# Altium schematic sheet Half_Bridge.SchDoc
size A
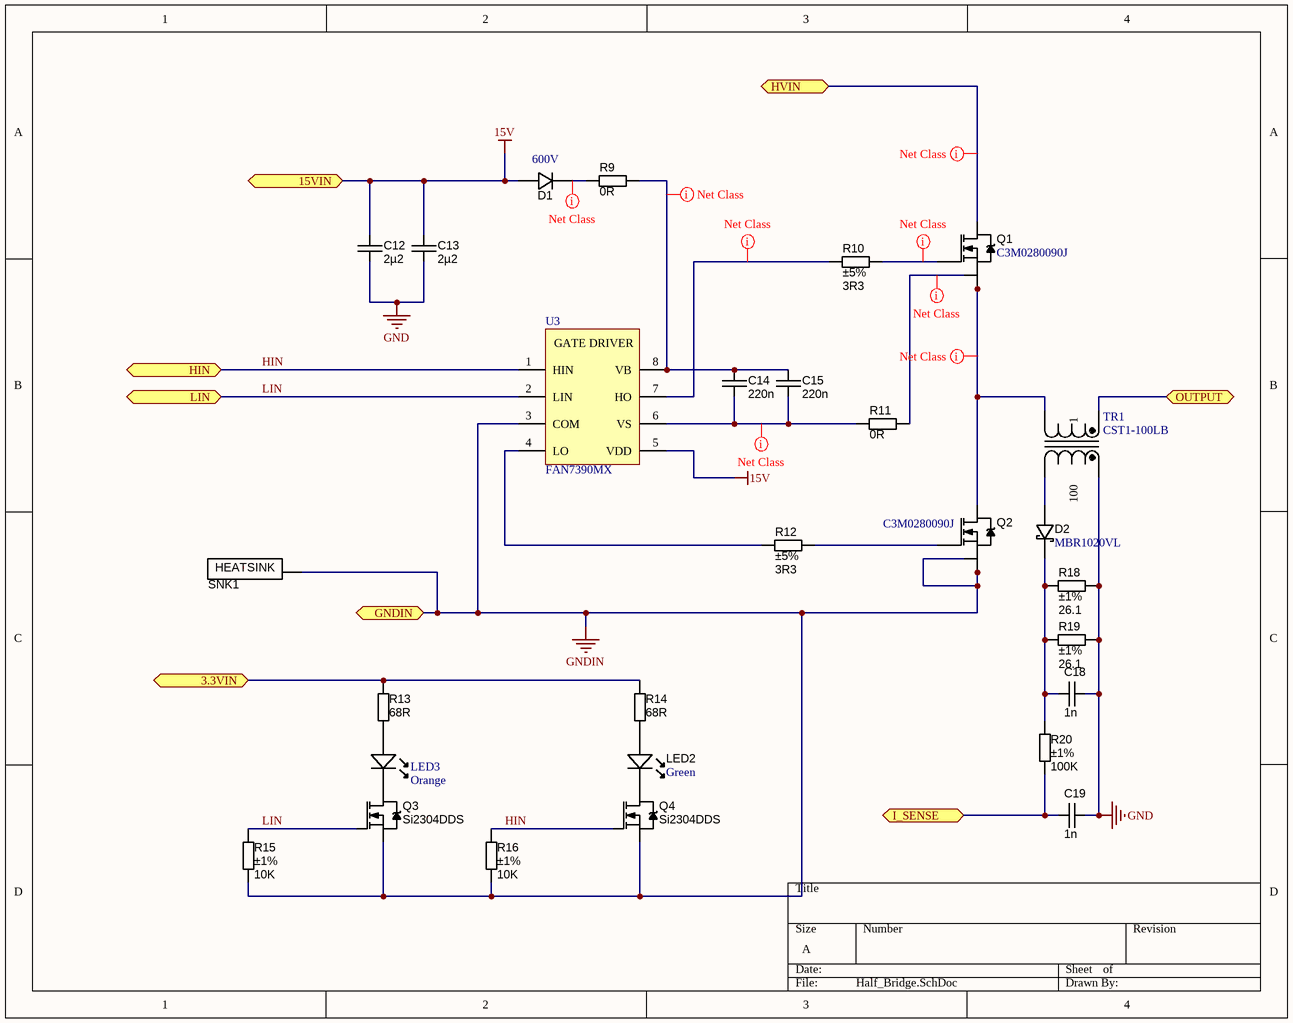
[diagram p0: Half_Bridge.SchDoc]

## Parts
C12  value 2µ2  [CAPC3216X180N]  (hidden comment: approved sub OK)
C13  value 2µ2  [CAPC3216X180N]  (hidden comment: approved sub OK)
C14  value 220n  [CAPC1632X07N]  (hidden comment: approved sub OK)
C15  value 220n  [CAPC1632X07N]  (hidden comment: approved sub OK)
C18  value 1n  [CAPC1608X90N]  (hidden comment: approved sub OK)
C19  value 1n  [CAPC1608X90N]  (hidden comment: approved sub OK)
D1  Voltage - DC Reverse (Vr) (Max): 600V  [DO-214AA]  (hidden comment: ER2J-LTP)
D2  Manufacturer Part Number: MBR1020VL  [SOD123F]  (hidden comment: B320A-13-F)
LED2  Color: Green  [LED-0603-GREEN]  (hidden comment: APT1608CGCK)
LED3  Color: Orange  [LED-0603-AMBER]  (hidden comment: LO L296-Q2S1-24-Z)
Q1  Manufacturer Part Number: C3M0280090J  [DPAK127P1618X457-8N]  (hidden comment: C3M0065090D)
Q2  Manufacturer Part Number: C3M0280090J  [DPAK127P1618X457-8N]  (hidden comment: C3M0065090D)
Q3  Si2304DDS  [SOT23-3]
Q4  Si2304DDS  [SOT23-3]
R9  value 0R  [RESC2012X70N]  (hidden comment: Jumper)
R10  value 3R3  Tolerance: ±5%  [RESC2012X70N]  (hidden comment: Thick Film)
R11  value 0R  [RESC2012X70N]  (hidden comment: Jumper)
R12  value 3R3  Tolerance: ±5%  [RESC2012X70N]  (hidden comment: Thick Film)
R13  value 68R  [RESC1608X55N]  (hidden comment: Thick Film)
R14  value 68R  [RESC1608X55N]  (hidden comment: Thick Film)
R15  value 10K  Tolerance: ±1%  [RESC1005X40N]  (hidden comment: Thick Film)
R16  value 10K  Tolerance: ±1%  [RESC1005X40N]  (hidden comment: Thick Film)
R18  value 26.1  Tolerance: ±1%  [RESC2012X70N]  (hidden comment: Thick Film)
R19  value 26.1  Tolerance: ±1%  [RESC2012X70N]  (hidden comment: Thick Film)
R20  value 100K  Tolerance: ±1%  [RESC1608X55N]  (hidden comment: Thick Film)
SNK1  ATS-CPX025025010-137-C2-R0  [HeatSink ATS-CPX025025010-165-C2-R0]  (value not drawn)
TR1  CST1-100LB  [CST1]
U3  FAN7390MX  [SOIC127P600X175-8AN]

## Ports
3.3VIN, 15VIN, GNDIN, HIN, HVIN, I_SENSE, LIN, OUTPUT

## Nets
15V: C12.1 C13.1 D1.A U3.5(VDD) ; port 15VIN
GND: C12.2 C13.2 C18.2 C19.2 R18.2 R19.2 TR1.6
GNDIN: Q2.2 Q2.3(S) Q2.4 Q2.5 Q2.6 Q2.7 Q3.2(S) Q4.2(S) R15.2 R16.2 SNK1.1(GND) U3.3(COM) ; port GNDIN
3.3VIN: R13.1 R14.1 ; port 3.3VIN
HIN: Q4.1(G) R16.1 U3.1(HIN) ; port HIN
HVIN: Q1.8(D) ; port HVIN
I_SENSE: C19.1 R20.1 ; port I_SENSE
LIN: Q3.1(G) R15.1 U3.2(LIN) ; port LIN
OUTPUT: TR1.8 ; port OUTPUT
NetC14_1: C14.1 C15.1 R9.2 U3.8(VB)
NetC14_2: C14.2 C15.2 R11.1 U3.6(VS)
NetC18_1: C18.1 D2.K R18.1 R19.1 R20.2
NetD1_K: D1.K R9.1
NetD2_A: D2.A TR1.4
NetLED2_A: LED2.A R14.2
NetLED2_K: LED2.K Q4.3(D)
NetLED3_A: LED3.A R13.2
NetLED3_K: LED3.K Q3.3(D)
NetQ1_1: Q1.1(G) R10.2
NetQ1_2: Q1.2 R11.2
NetQ1_3: Q1.3(S) Q1.4 Q1.5 Q1.6 Q1.7 Q2.8(D) TR1.7
NetQ2_1: Q2.1(G) R12.2
NetR10_1: R10.1 U3.7(HO)
NetR12_1: R12.1 U3.4(LO)

## Layout directives
net class BOOT_S: NetC14_1, NetC14_2, NetD1_K, NetQ1_1, NetQ1_2, NetQ1_3, NetR10_1
net class 350V: HVIN

## Notes on the sheet
- (in symbol CURRENT_100:1_20A_CST1-100LB) 1; 100
- (in symbol GATE_DRV_2_600V_4.5A) GATE DRIVER
- (in symbol HEATSINK_25mmx25mm_ATS-CPX025025010-137-C2-R0) HEATSINK

## Library data of the parts
C12 C13 = CAPC_2u2_50V_1206: Capacitor SMD Cer 2.2uF 10% 50V X7R 1206; SCDType: undef; Tolerance: ±10%; Supplier 1: Digi-Key; Supplier Part Number 1: 1276-1291-1-ND
C14 C15 = CAPC_220n_0612_X7R_25V_10%: Capacitor SMD Cer 220nF 10% 25V X7R 0612; Manufacturer: AVX Corporation; Manufacturer Part Number: 06123C224KAT2A; Tolerance: ±20%; Voltage - Rated: 25V; Supplier 1: Digi-Key; Supplier Part Number 1: 478-2902-1-ND; RoHS: RoHS Compliant; Category: Capacitors; Stock 1: 3680; Pricing 1: 1=1.73, 10=1.366, 100=1.0247, 500=0.77418, 1000=0.6831 (USD); Packaging: Cut Tape (CT); Part Status: Active; Temperature Coefficient: X7R; Operating Temperature: -55°C ~ 125°C; Features: Low ESL (Reverse Geometry); Ratings: -; Applications: Bypass, Decoupling; Mounting Type: Surface Mount, MLCC; Package / Case: 0612 (1632 Metric); Size / Dimension: 0.063" L x 0.126" W (1.60mm x 3.20mm); Height - Seated (Max): -; Thickness (Max): 0.050" (1.27mm); Lead Spacing: -; Lead Style: -; ComponentLink1URL: http://datasheets.avx.com/licc.pdf; ComponentLink1Description: http://datasheets.avx.com/licc.pdf
C18 C19 = CAPC_1n_0603_X7R_100V_10%: Capacitor SMD Cer 1nF 10% 100V X7R 0603; Manufacturer 1: Murata Electronics North America; Manufacturer Part Number 1: GCM188R72A102KA37D; Ratings: 100V; X7R; Material: ceramic; SCDType: spec; Package / Case: 0603 (1608 metric); Tolerance: ±10%; Supplier 1: Digi-Key; Supplier Part Number 1: 490-4780-1-ND; Operating Temperature: -55°C ~ 125°C; Size / Dimension: 0.063" L x 0.031" W (1.60mm x 0.80mm); Thickness (Max): 0.035" (0.90mm); ComponentLink1URL: http://search.murata.co.jp/Ceramy/image/img/PDF/ENG/GCM188R72A102KA37.pdf; ComponentLink1Description: http://search.murata.co.jp/Ceramy/image/img/PDF/ENG/GCM188R72A102KA37.pdf
D1 = DIODE_600V_2A_ER2J-LTP: Diode Standard 600V 2A Surface Mount DO-214AA (SMB); Manufacturer: Micro Commercial Co; Voltage - Forward (Vf) (Max) @ If: 1.7V @ 2A; Speed: Fast Recovery =< 500ns, > 200mA (Io); Current - Reverse Leakage @ Vr: 5µA @ 600V; Capacitance @ Vr, F: 15pF @ 4V, 1MHz; Supplier 1: Digi-Key; Supplier Part Number 1: ER2J-LTPMSCT-ND; RoHS: RoHS Compliant; Category: Discrete Semiconductor Products; Stock 1: 527; Pricing 1: 1=0.51, 10=0.362, 25=0.2976, 100=0.2379, 250=0.17304, 500=0.1406, 1000=0.10815 (USD); Packaging: Cut Tape (CT); Part Status: Active; Diode Type: Standard; Current - Average Rectified (Io): 2A; Mounting Type: Surface Mount; Package / Case: DO-214AA, SMB; Supplier Device Package: DO-214AA (SMB); Operating Temperature - Junction: -65°C ~ 175°C; ComponentLink1URL: http://www.mccsemi.com/up_pdf/ER2A-L~ER2J-L(DO-214AA).pdf; ComponentLink1Description: http://www.mccsemi.com/up_pdf/ER2A-L~ER2J-L(DO-214AA).pdf; Manufacturer Part Number: ER2J-LTP
D2 = DIODE_SCHOTTKY_20V_1A_MBR1020VL: Diode Schottky 20V 1A Surface Mount SOD-123F; Manufacturer: Fairchild/ON Semiconductor; Voltage - Forward (Vf) (Max) @ If: 340mV @ 1A; Speed: Fast Recovery =< 500ns, > 200mA (Io); Current - Reverse Leakage @ Vr: 600µA @ 20V; Supplier 1: Digi-Key; Supplier Part Number 1: MBR1020VLCT-ND; RoHS: RoHS Compliant; Category: Discrete Semiconductor Products; Stock 1: 10857; Pricing 1: 1=0.39, 10=0.293, 100=0.1661, 500=0.11, 1000=0.08433 (USD); Packaging: Cut Tape (CT); Part Status: Active; Diode Type: Schottky; Current - Average Rectified (Io): 1A; Capacitance @ Vr, F: -; Mounting Type: Surface Mount; Package / Case: SOD-123F; Supplier Device Package: SOD-123F; Operating Temperature - Junction: -55°C ~ 125°C; ComponentLink1URL: https://www.fairchildsemi.com/datasheets/MB/MBR1020VL.pdf; ComponentLink1Description: https://www.fairchildsemi.com/datasheets/MB/MBR1020VL.pdf
LED2 = LED_SMD_Green_0603_50mcd: Green 570nm LED Indication - Discrete 2.1V 0603 (1608 Metric); Manufacturer: Kingbright; Lens Color: Colorless; Lens Transparency: Clear; Millicandela Rating: 50mcd; Lens Style/Size: Rectangle with Flat Top, 1.20mm x 0.80mm; Current - Test: 20mA; Viewing Angle: 120°; Wavelength - Peak: 574nm; Supplier 1: Digi-Key; Supplier Part Number 1: 754-1116-1-ND; Manufacturer Part Number: APT1608CGCK; Packaging: Cut Tape (CT); Part Status: Active; Voltage - Forward (Vf) (Typ): 2.1V; Mounting Type: Surface Mount; Wavelength - Dominant: 570nm; Features: -; Package / Case: 0603 (1608 Metric); Supplier Device Package: Chip LED; Size / Dimension: 1.60mm L x 0.80mm W; Height (Max): 0.75mm; ComponentLink1URL: http://www.kingbrightusa.com/images/catalog/SPEC/APT1608CGCK.pdf; ComponentLink1Description: http://www.kingbrightusa.com/images/catalog/SPEC/APT1608CGCK.pdf; RoHS: RoHS Compliant; Category: Optoelectronics; Stock 1: 896844; Pricing 1: 1=0.47, 10=0.337, 25=0.258, 100=0.1683, 250=0.12344, 500=0.10472, 1000=0.08602 (USD)
LED3 = LED_0603_Orange: LED ORANGE DIFFUSED 0603 SMD; Manufacturer: OSRAM Opto Semiconductors Inc.; Lens Color: White; Millicandela Rating: 157mcd; Lens Style/Size: Rectangle with Flat Top, 1.30mm x 0.80mm; Voltage - Forward (Vf) (Typ): 2V; Current - Test: 20mA; Viewing Angle: 160°; Wavelength - Dominant: 605nm; Supplier 1: Digi-Key; Manufacturer Part Number: LO L296-Q2S1-24-Z; Packaging: Cut Tape (CT); Part Status: Active; Lens Transparency: Diffused; Mounting Type: Surface Mount; Wavelength - Peak: -; Features: -; Package / Case: 0603 (1608 Metric); Size / Dimension: 1.70mm L x 0.80mm W; Height (Max): 0.65mm; ComponentLink1URL: http://www.osram-os.com/Graphics/XPic9/00077122_0.pdf; ComponentLink1Description: http://www.osram-os.com/Graphics/XPic9/00077122_0.pdf; Supplier Part Number 1: 475-2739-1-ND; RoHS: RoHS Compliant; Category: Optoelectronics; Stock 1: 4435; Pricing 1: 1=0.34, 10=0.245, 25=0.2004, 100=0.1603, 250=0.13524, 500=0.11522, 1000=0.09017, 2500=0.08349 (USD)
Q1 Q2 = SiC_N-CHAN_900V_11A_C3M0280090J: N-Channel 36A (Tc) 125W (Tc) Through Hole TO-247-3; Manufacturer: Cree/Wolfspeed; Current - Continuous Drain (Id) @ 25°C: 11A (Tc); Drive Voltage (Max Rds On,  Min Rds On): 15V; Vgs(th) (Max) @ Id: 3.5V @ 1.2mA; Gate Charge (Qg) (Max) @ Vgs: 9.5nC @ 15V; Input Capacitance (Ciss) (Max) @ Vds: 150pF @ 600V; Vgs (Max): +18V, -8V; Power Dissipation (Max): 50W (Tc); Rds On (Max) @ Id, Vgs: 360 mOhm @ 7.5A, 15V; Supplier 1: Digi-Key; Supplier Part Number 1: C3M0280090J-ND; RoHS: RoHS Compliant; Category: Discrete Semiconductor Products; Stock 1: 713; Pricing 1: 1=3.84 (USD); Packaging: Tube; Part Status: Active; FET Type: N-Channel; Technology: SiCFET (Silicon Carbide); FET Feature: -; Operating Temperature: -55°C ~ 150°C (TJ); Mounting Type: Surface Mount; Supplier Device Package: D2PAK-7; Package / Case: TO-263-8, D²Pak (7 Leads + Tab), TO-263CA; ComponentLink1URL: http://www.wolfspeed.com/media/downloads/835/C3M0280090J.pdf; ComponentLink1Description: http://www.wolfspeed.com/media/downloads/835/C3M0280090J.pdf
Q3 Q4 = MOSFET_Si2304DDS: MOSFET SMD N-CH 30V 3.6A 1.7W SOT23-3; Material: Metal Oxide; SCDType: source; Ratings: 30V; 3.6A; Package / Case: SOT23-3; Supplier 1: Digi-Key; Supplier Part Number 1: SI2304DDS-T1-GE3CT-ND
R9 R11 = RES_0R_0805: Resistor SMD chip 0.0 Ohm 0.125W 0805; Manufacturer 1: Samsung Electro-Mechanics America, Inc; Manufacturer Part Number 1: RC2012J000CS; Ratings: 1/8W; SCDType: spec; Tolerance: N/A; Package / Case: 0805 (2012 metric); Supplier 1: Digi-Key; Supplier Part Number 1: 1276-5466-6-ND; RoHS 1: RoHS Compliant; ComponentLink1URL: http://www.samsungsem.com/servlet/FileDownload?filename=productcatalog/pdf/Chip_Resistor.pdf; ComponentLink1Description: http://www.samsungsem.com/servlet/FileDownload?filename=productcatalog/pdf/Chip_Resistor.pdf; Supplier 2: Digi-Key; Supplier Part Number 2: RMCF0805ZT0R00DKR-ND; Manufacturer 2: Stackpole Electronics Inc; Manufacturer Part Number 2: RMCF0805ZT0R00; RoHS 2: RoHS Compliant; ComponentLink2URL: http://www.seielect.com/Catalog/SEI-RMCF_RMCP.pdf; ComponentLink2Description: http://www.seielect.com/Catalog/SEI-RMCF_RMCP.pdf; Supplier 3: Digi-Key; Supplier Part Number 3: 311-0.0ARDKR-ND; Manufacturer 3: Yageo; Manufacturer Part Number 3: RC0805JR-070RL; RoHS 3: RoHS Compliant; ComponentLink3URL: http://media.digikey.com/pdf/Data%20Sheets/Yageo%20PDFs/RC0805%20Pb%20Free.pdf; ComponentLink3Description: http://media.digikey.com/pdf/Data%20Sheets/Yageo%20PDFs/RC0805%20Pb%20Free.pdf; Supplier 4: Digi-Key; Supplier Part Number 4: P0.0ADKR-ND; Manufacturer 4: Panasonic Electronic Components; Manufacturer Part Number 4: ERJ-6GEY0R00V; RoHS 4: RoHS Compliant; ComponentLink4URL: http://industrial.panasonic.com/www-cgi/jvcr13pz.cgi?E+PZ+3+AOA0001+ERJ6GEY0R00V+7+WW; ComponentLink4Description: http://industrial.panasonic.com/www-cgi/jvcr13pz.cgi?E+PZ+3+AOA0001+ERJ6GEY0R00V+7+WW; Supplier 5: Digi-Key; Supplier Part Number 5: RHM0.0CPDKR-ND; Manufacturer 5: Rohm Semiconductor; Manufacturer Part Number 5: MCR10ERTJ000; RoHS 5: RoHS Compliant; ComponentLink5URL: http://rohmfs.rohm.com/en/products/databook/datasheet/passive/resistor/chip_resistor/mcr_g.pdf; ComponentLink5Description: http://rohmfs.rohm.com/en/products/databook/datasheet/passive/resistor/chip_resistor/mcr_g.pdf
R10 R12 = RES_3R3_0805_5%: Resistor SMD chip 3.3 Ohm 0.5W 0805; Manufacturer: Panasonic Electronic Components; Manufacturer Part Number: ERJ-6DQJ3R0V; Power (Watts): 0.5W, 1/2W; Temperature Coefficient: ±100ppm/°C; Supplier 1: Digi-Key; Supplier Part Number 1: P19231CT-ND; RoHS: RoHS Compliant; Category: Resistors; Stock 1: 3694; Pricing 1: 1=0.23, 10=0.198, 25=0.1444, 50=0.1046, 100=0.0776, 250=0.05952, 500=0.0469, 1000=0.03247 (USD); Packaging: Cut Tape (CT); Part Status: Active; Composition: Thick Film; Features: Automotive AEC-Q200, Current Sense; Operating Temperature: -55°C ~ 155°C; Package / Case: 0805 (2012 Metric); Supplier Device Package: 0805; Size / Dimension: 0.079" L x 0.049" W (2.00mm x 1.25mm); Height - Seated (Max): 0.028" (0.70mm); Failure Rate: -; ComponentLink1URL: https://industrial.panasonic.com/cdbs/www-data/pdf/RDN0000/AOA0000C313.pdf; ComponentLink1Description: https://industrial.panasonic.com/cdbs/www-data/pdf/RDN0000/AOA0000C313.pdf
R13 R14 = RES_68R_0603_5%: Resistor SMD chip 68 Ohm 0.1W 5% 0603; Manufacturer 1: Yageo; Manufacturer Part Number 1: RC0603JR-0768RL; Ratings: 1/10 W; SCDType: spec; Package / Case: 0603 (1608 metric); Tolerance: ±5%; Material: Thick Film; Supplier 1: Digi-Key; Supplier Part Number 1: 311-68GRCT-ND
R15 R16 = RES_10K_0402_1%: Resistor SMD chip 10k Ohm 0.063W 1% 0402; Manufacturer 1: Vishay Dale; Manufacturer Part Number 1: CRCW040210K0FKED; Ratings: 1/16 W; SCDType: spec; Package / Case: 0402 (1005 Metric); Manufacturer 2: Yageo; Manufacturer Part Number 2: RC0402FR-0710KL; Supplier 1: Digi-Key; Supplier Part Number 1: 541-10.0KLCT-ND; ComponentLink1URL: http://www.vishay.com/doc?20035; ComponentLink1Description: http://www.vishay.com/doc?20035; Supplier 2: Digi-Key; Supplier Part Number 2: 311-10.0KLRCT-ND; ComponentLink2URL: http://www.yageo.com/documents/recent/PYu-RC0402_51_RoHS_L_6.pdf; ComponentLink2Description: http://www.yageo.com/documents/recent/PYu-RC0402_51_RoHS_L_6.pdf
R18 R19 = RES_26R1_0805_1%: Resistor SMD chip 26.1k Ohm 0.125W 1% 0805; Manufacturer: Panasonic Electronic Components; Manufacturer Part Number: ERJ-6ENF26R1V; Power (Watts): 0.125W, 1/8W; Temperature Coefficient: ±100ppm/°C; Supplier 1: Digi-Key; Supplier Part Number 1: P26.1CCT-ND; RoHS: RoHS Compliant; Category: Resistors; Stock 1: 23109; Pricing 1: 1=0.1, 10=0.041, 100=0.0167, 1000=0.00749, 2500=0.0065 (USD); Packaging: Cut Tape (CT); Part Status: Active; Composition: Thick Film; Features: Automotive AEC-Q200; Operating Temperature: -55°C ~ 155°C; Package / Case: 0805 (2012 Metric); Supplier Device Package: 0805; Size / Dimension: 0.079" L x 0.049" W (2.00mm x 1.25mm); Height - Seated (Max): 0.028" (0.70mm); Failure Rate: -; ComponentLink1URL: https://industrial.panasonic.com/cdbs/www-data/pdf/RDA0000/AOA0000C304.pdf; ComponentLink1Description: https://industrial.panasonic.com/cdbs/www-data/pdf/RDA0000/AOA0000C304.pdf
R20 = RES_100K_0603_1%: Resistor SMD chip 100k Ohm 0.1W 1% 0603; Manufacturer 1: Vishay/Dale; Manufacturer Part Number 1: CRCW0603100KFKEA; Ratings: 1/10W; SCDType: spec; Package / Case: 0603 (2012 metric); Supplier 1: Digi-Key; Supplier Part Number 1: 541-100KHCT-ND
SNK1 = HEATSINK_25mmx25mm_ATS-CPX025025010-137-C2-R0: Heat Sink Assorted (BGA, LGA, CPU, ASIC...) Aluminum Top Mount; Manufacturer: Advanced Thermal Solutions Inc.; Attachment Method: Push Pin; Shape: Square, Fins; Thermal Resistance @ Forced Air Flow: 18.36°C/W @ 100 LFM; Material Finish: Blue Anodized; Supplier 1: Digi-Key; Supplier Part Number 1: ATS1514-ND; RoHS: RoHS Compliant; Category: Fans, Thermal Management; Stock 1: 1318; Pricing 1: 1=2.86, 10=2.784, 25=2.7088, 50=2.5584, 100=2.4078, 250=2.25736, 500=2.1821, 1000=1.95637, 5000=1.91875 (USD); Part Status: Active; Type: Top Mount; Package Cooled: Assorted (BGA, LGA, CPU, ASIC...); Length: 0.984" (25.00mm); Width: 0.984" (25.00mm); Diameter: -; Height Off Base (Height of Fin): 0.394" (10.00mm); Power Dissipation @ Temperature Rise: -; Thermal Resistance @ Natural: -; Material: Aluminum; ComponentLink1URL: https://www.qats.com/pushPIN/DataSheet/ATS-CPX025025010-137-C2-R0; ComponentLink1Description: https://www.qats.com/pushPIN/DataSheet/ATS-CPX025025010-137-C2-R0; Manufacturer Part Number: ATS-CPX025025010-137-C2-R0
TR1 = CURRENT_100:1_20A_CST1-100LB: Sufrace Mount Current Transformer 100:1 Ratio 20A; Frequency: 9kHz-1000kHz; Ratio: 100:1; Current (Max): 20A; Manufacturer Part Number: CST1-100LB
U3 = GATE_DRV_2_600V_4.5A: Half-Bridge Gate Driver IC Non-Inverting 8-SOP; Manufacturer: Fairchild/ON Semiconductor; Channel Type: Independent; Gate Type: IGBT, N-Channel MOSFET; Voltage - Supply: 10 V ~ 22 V; Logic Voltage - VIL, VIH: 1.2V, 2.5V; Current - Peak Output (Source, Sink): 4.5A, 4.5A; Rise / Fall Time (Typ): 25ns, 20ns; Supplier 1: Digi-Key; Supplier Part Number 1: FAN7390MXCT-ND; RoHS: RoHS Compliant; Category: Integrated Circuits (ICs); Stock 1: 5064; Pricing 1: 1=1.79, 10=1.61, 100=1.2944, 500=1.06348, 1000=0.88117 (USD); Packaging: Cut Tape (CT); Part Status: Active; Driven Configuration: Half-Bridge; Input Type: Non-Inverting; Operating Temperature: -40°C ~ 150°C (TJ); Mounting Type: Surface Mount; Package / Case: 8-SOIC (0.154", 3.90mm Width); Supplier Device Package: 8-SOP; ComponentLink1URL: https://www.fairchildsemi.com/datasheets/FA/FAN7390.pdf; ComponentLink1Description: https://www.fairchildsemi.com/datasheets/FA/FAN7390.pdf; Manufacturer Part Number: FAN7390MX